# Altium schematic sheet PDU_Top_Level.SchDoc
size 431 x 279 mm; Organization: ORGANIZATION; Address1: ADDRESS 1; Address2: ADDRESS 2; Address3: ADDRESS 3; Address4: ADDRESS 4; Revision: -; SheetNumber: 1; SheetTotal: 6; ENG_APP_DATE: --/--/--; DSN_APP_DATE: --/--/--; CHK_APP_DATE: --/--/--
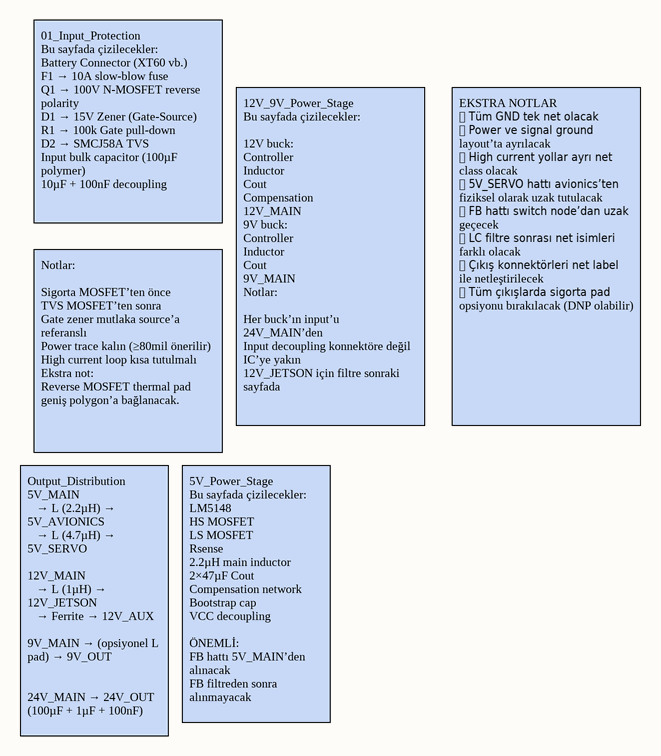
[diagram p0: PDU_Top_Level.SchDoc]

## Notes on the sheet
- 01_Input_Protection
  Bu sayfada çizilecekler:
  Battery Connector (XT60 vb.)
  F1 → 10A slow-blow fuse
  Q1 → 100V N‑MOSFET reverse polarity
  D1 → 15V Zener (Gate‑Source)
  R1 → 100k Gate pull‑down
  D2 → SMCJ58A TVS
  Input bulk capacitor (100µF polymer)
  10µF + 100nF decoupling
- 12V_9V_Power_Stage
  Bu sayfada çizilecekler:
  12V buck:
  Controller
  Inductor
  Cout
  Compensation
  12V_MAIN
  9V buck:
  Controller
  Inductor
  Cout
  9V_MAIN
  Notlar:
  Her buck’ın input’u 24V_MAIN’den
  Input decoupling konnektöre değil IC’ye yakın
  12V_JETSON için filtre sonraki sayfada
- EKSTRA NOTLAR
  ✅ Tüm GND tek net olacak
  ✅ Power ve signal ground layout’ta ayrılacak
  ✅ High current yollar ayrı net class olacak
  ✅ 5V_SERVO hattı avionics’ten fiziksel olarak uzak tutulacak
  ✅ FB hattı switch node’dan uzak geçecek
  ✅ LC filtre sonrası net isimleri farklı olacak
  ✅ Çıkış konnektörleri net label ile netleştirilecek
  ✅ Tüm çıkışlarda sigorta pad opsiyonu bırakılacak (DNP olabilir)
- Notlar:
  Sigorta MOSFET’ten önce
  TVS MOSFET’ten sonra
  Gate zener mutlaka source’a referanslı
  Power trace kalın (≥80mil önerilir)
  High current loop kısa tutulmalı
  Ekstra not:
  Reverse MOSFET thermal pad geniş polygon’a bağlanacak.
- Output_Distribution
  5V_MAIN
  → L (2.2µH) → 5V_AVIONICS
  → L (4.7µH) → 5V_SERVO
  12V_MAIN
  → L (1µH) → 12V_JETSON
  → Ferrite → 12V_AUX
  9V_MAIN → (opsiyonel L pad) → 9V_OUT
  24V_MAIN → 24V_OUT
  (100µF + 1µF + 100nF)
- 5V_Power_Stage
  Bu sayfada çizilecekler:
  LM5148
  HS MOSFET
  LS MOSFET
  Rsense
  2.2µH main inductor
  2×47µF Cout
  Compensation network
  Bootstrap cap
  VCC decoupling
  ÖNEMLİ:
  FB hattı 5V_MAIN’den alınacak
  FB filtreden sonra alınmayacak
- DWG. NO.
- REV.
- SHT.
- THIS DOCUMENT AND THE DATA DISCLOSED HEREIN OR HEREWITH IS THE PROPERTY OF ALTIUM LIMITED AND MAY BE FREELY DISTRIBUTED IN WHOLE. NO RIGHTS ARE RESERVED OR EXPRESS OR IMPLIED WARANTEE GIVEN.
- REVISION
- DESCRIPTION
- DATE
- APPROVED
- ENG:
- APPROVALS
- PROJECT
- DSN:
- CHK:
- REFERENCE DOCUMENTS
- PROJECT REVISION:
- TITLE
- DOCUMENT REVISION:
- DESIGN ITEM:
- BOM:
- FAB DWG:
- PCB DWG:
- ASSY DWG:
- SCALE:
- SIZE
- B
- CAGE CODE
- FILE NAME
- DWG NO.
- SHEET
- OF
- REV